# EAGLE design simple-loop-screwsfixed (EAGLE 6.6.0)

## Sheet 1 of 2
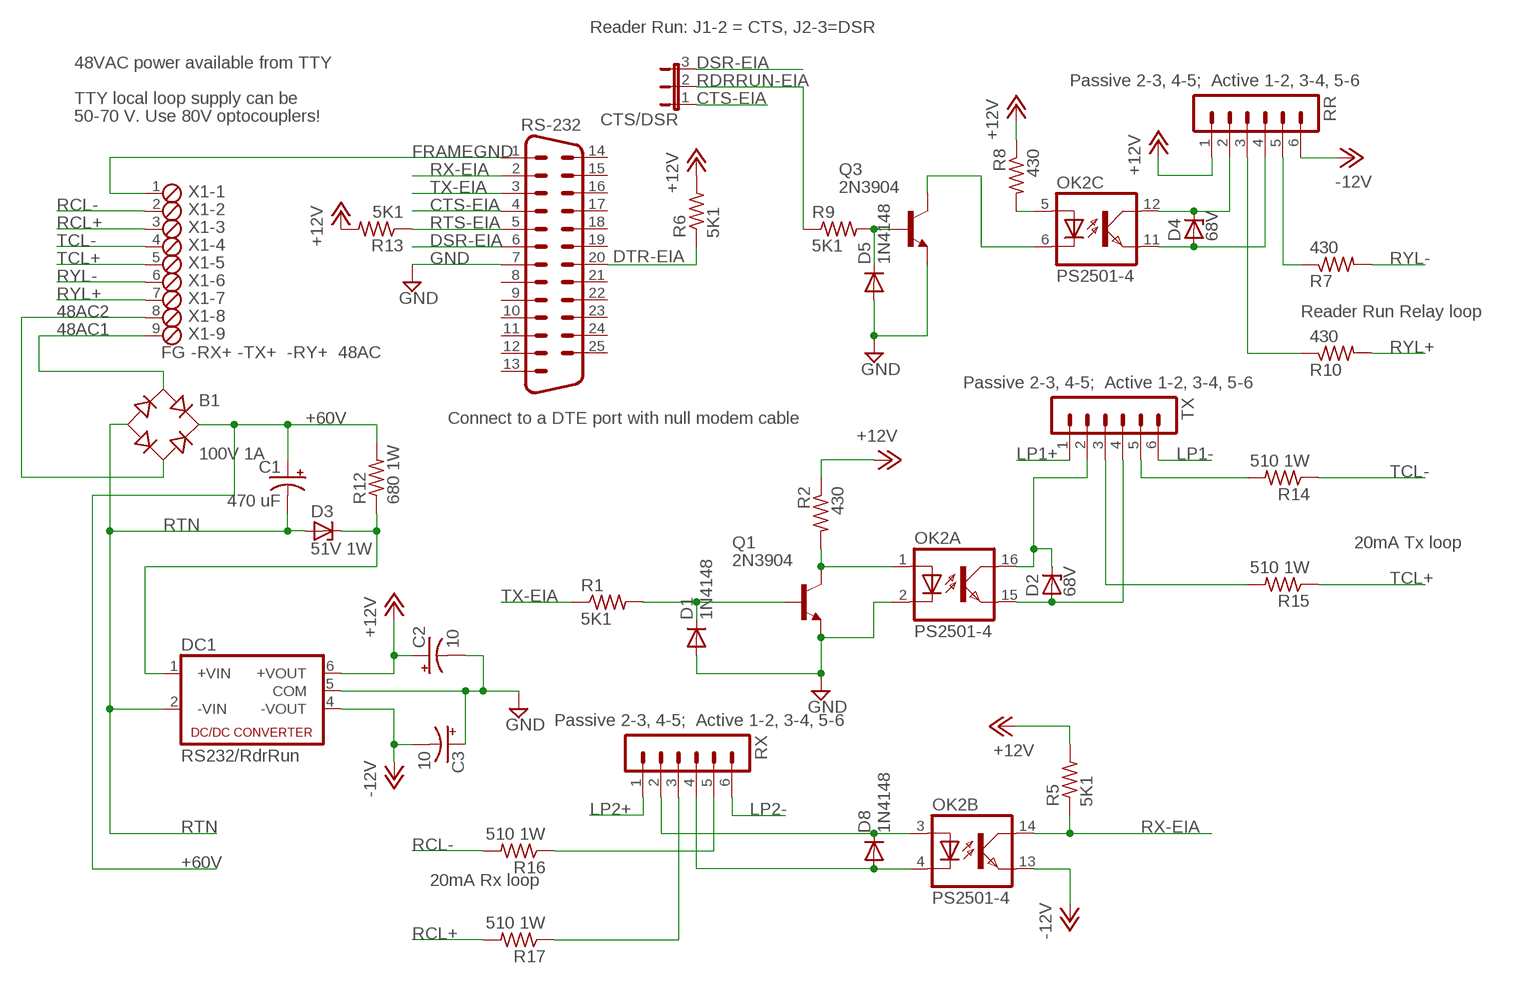
[diagram p0: schematic, sheet 1]

### Parts
B1  100V 1A  RB1A  [RB1A]
C1  470 uF  CPOL-USE7.5-18  [E7,5-18]
C2  10  CPOL-USB45181A  [B45181A]
C3  10  CPOL-USB45181A  [B45181A]
CTS/DSR  JP2E  [JP2]
D1  1N4148  1N4148DO35-10  [DO35-10]
D2  68V  ZENER-DIODEDO41Z10  [DO41Z10]
D3  51V 1W  ZENER-DIODEDO41Z10  [DO41Z10]
D4  68V  ZENER-DIODEDO41Z10  [DO41Z10]
D5  1N4148  1N4148DO35-10  [DO35-10]
D8  1N4148  1N4148DO35-10  [DO35-10]
DC1  RS232/RdrRun  NMA  [NMA]
OK2  PS2501-4  PC847  [DIL16]
Q1  2N3904  [TO92]
Q3  2N3904  [TO92]
R1  5K1  R-US_0207/10  [0207/10]
R2  430  R-US_0207/10  [0207/10]
R5  5K1  R-US_0207/10  [0207/10]
R6  5K1  R-US_0207/10  [0207/10]
R7  430  R-US_0207/10  [0207/10]
R8  430  R-US_0207/10  [0207/10]
R9  5K1  R-US_0207/10  [0207/10]
R10  430  R-US_0207/10  [0207/10]
R12  680 1W  R-US_0817/7V  [P0817V]
R13  5K1  R-US_0207/10  [0207/10]
R14  510 1W  R-US_0817/7V  [P0817V]
R15  510 1W  R-US_0817/7V  [P0817V]
R16  510 1W  R-US_0817/7V  [P0817V]
R17  510 1W  R-US_0817/7V  [P0817V]
RR  MA06-1  [MA06-1]
RS-232  M25H  [M25H]
RX  MA06-1  [MA06-1]
TX  MA06-1  [MA06-1]
X1  FG -RX+ -TX+ -RY+ 48AC  MPT9  [9POL254]

### Nets
48AC1: B1.AC1 X1.9
48AC2: B1.AC2 X1.8
+12V: C2.+ DC1.6(+VOUT) R2.1 R5.2 R6.2 R8.1 R13.2 RR.1
+48VDC: D3.C DC1.1(+VIN) R12.1
+60V: B1.+ C1.+ R12.2 ; also sheet 2
-12V: C3.- DC1.4(-VOUT) OK2.13(B:EMIT) RR.6
CTS-EIA: CTS/DSR.1 RS-232.4
DSR-EIA: CTS/DSR.3 RS-232.6
DTR-EIA: R6.1 RS-232.20
FRAMEGND: RS-232.1 X1.1
GND [GND]: C2.- C3.+ D1.A D5.A DC1.5(COM) OK2.2(A:C) Q1.3(E) Q3.3(E) RS-232.7
LP1+: TX.1 ; also sheet 2
LP1-: TX.6 ; also sheet 2
LP2+: RX.1 ; also sheet 2
LP2-: RX.6 ; also sheet 2
N$1: D8.C OK2.3(B:A) RX.2
N$2: R16.1 RX.5
N$3: D8.A OK2.4(B:C) RX.4
N$4: D2.A OK2.15(A:EMIT) TX.4
N$5: OK2.5(C:A) R8.2
N$6: D2.C OK2.16(A:COL) TX.2
N$7: D1.C Q1.2(B) R1.2
N$8: D4.C OK2.12(C:COL) RR.2
N$9: OK2.1(A:A) Q1.1(C) R2.2
N$10: R10.1 RR.3
N$11: R7.1 RR.5
N$15: OK2.6(C:C) Q3.1(C)
N$16: D5.C Q3.2(B) R9.2
N$19: R14.2 TX.5
N$20: R17.1 RX.3
N$21: R15.2 TX.3
N$22: D4.A OK2.11(C:EMIT) RR.4
RCL+: R17.2 X1.3
RCL-: R16.2 X1.2
RDRRUN-EIA: CTS/DSR.2 R9.1
RTN: B1.- C1.- D3.A DC1.2(-VIN) ; also sheet 2
RTS-EIA: R13.1 RS-232.5
RX-EIA: OK2.14(B:COL) R5.1 RS-232.2
RYL+: R10.2 X1.7
RYL-: R7.2 X1.6
TCL+: R15.1 X1.5
TCL-: R14.1 X1.4
TX-EIA: R1.1 RS-232.3
Unconnected: RS-232.8 RS-232.9 RS-232.10 RS-232.11 RS-232.12 RS-232.13 RS-232.14 RS-232.15 RS-232.16 RS-232.17 RS-232.18 RS-232.19 RS-232.21 RS-232.22 RS-232.23 RS-232.24 RS-232.25

### Notes on the sheet
- Reader Run: J1-2 = CTS, J2-3=DSR
- 48VAC power available from TTY
- Passive 2-3, 4-5;  Active 1-2, 3-4, 5-6
- TTY local loop supply can be
- 50-70 V. Use 80V optocouplers!
- Reader Run Relay loop
- Passive 2-3, 4-5;  Active 1-2, 3-4, 5-6
- Connect to a DTE port with null modem cable
- 20mA Tx loop
- Passive 2-3, 4-5;  Active 1-2, 3-4, 5-6
- 20mA Rx loop

## Sheet 2 of 2
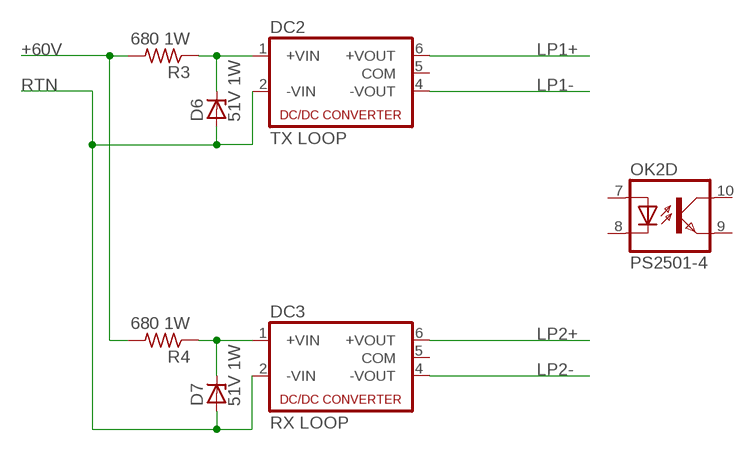
[diagram p1: schematic, sheet 2]

### Parts
D6  51V 1W  ZENER-DIODEDO41Z10  [DO41Z10]
D7  51V 1W  ZENER-DIODEDO41Z10  [DO41Z10]
DC2  TX LOOP  NMA  [NMA]
DC3  RX LOOP  NMA  [NMA]
R3  680 1W  R-US_0817/7V  [P0817V]
R4  680 1W  R-US_0817/7V  [P0817V]

### Nets
+48VDC1: D6.C DC2.1(+VIN) R3.1
+48VDC2: D7.C DC3.1(+VIN) R4.1
+60V: R3.2 R4.2 ; also sheet 1
LP1+: DC2.6(+VOUT) ; also sheet 1
LP1-: DC2.4(-VOUT) ; also sheet 1
LP2+: DC3.6(+VOUT) ; also sheet 1
LP2-: DC3.4(-VOUT) ; also sheet 1
RTN: D6.A D7.A DC2.2(-VIN) DC3.2(-VIN) ; also sheet 1
Unconnected: DC2.5(COM) DC3.5(COM) OK2.7(D:A) OK2.8(D:C) OK2.9(D:EMIT) OK2.10(D:COL)

## Library data of the parts
B1 = rectifier:RB1A: RECTIFIER 1 A
C1-C3 = rcl:CPOL-US: POLARIZED CAPACITOR, American symbol
CTS/DSR = jumper:JP2E: JUMPER
D1 D5 D8 = diode:1N4148: DIODE high speed (Philips)
D2-D4 D6 D7 = diode:ZENER-DIODE: Z-Diode
DC1-DC3 = dc-dc-converter:NMA: DC-DC CONVERTER; MF: C & D TECHNOLOGIES, INC; MPN: NMA0515SC; OC_FARNELL: 1021434; OC_NEWARK: 61K3064
OK2 = optocoupler:PC847: SHARP OPTO COUPLER; OC_FARNELL: 9707735; OC_NEWARK: unknown
Q1 Q3 = transistor-npn:2N3904: NPN Transistor
R1-R10 R12-R17 = rcl:R-US_: RESISTOR, American symbol
RR RX TX = con-lstb:MA06-1: PIN HEADER; OC_FARNELL: unknown; OC_NEWARK: unknown
RS-232 = con-subd:M25: SUB-D; OC_FARNELL: unknown; OC_NEWARK: unknown
X1 = con-phoenix-254:MPT9: PHOENIX CONNECTOR; OC_FARNELL: unknown; OC_NEWARK: unknown

## Net classes
1 GND: width 0.508 mm

## Board
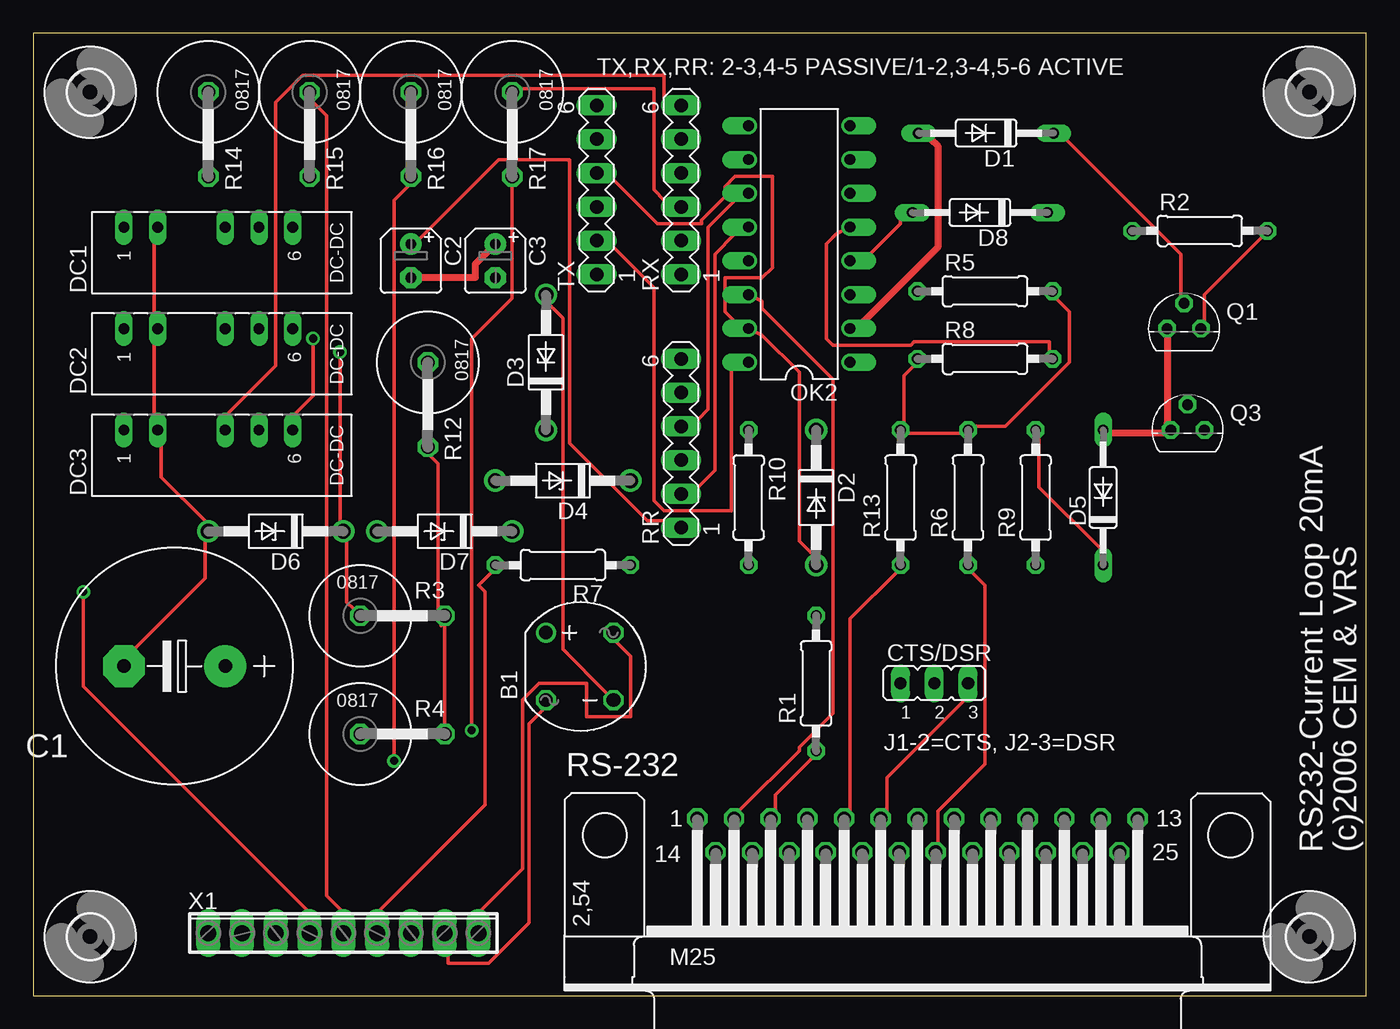
[diagram p2: board, top side]
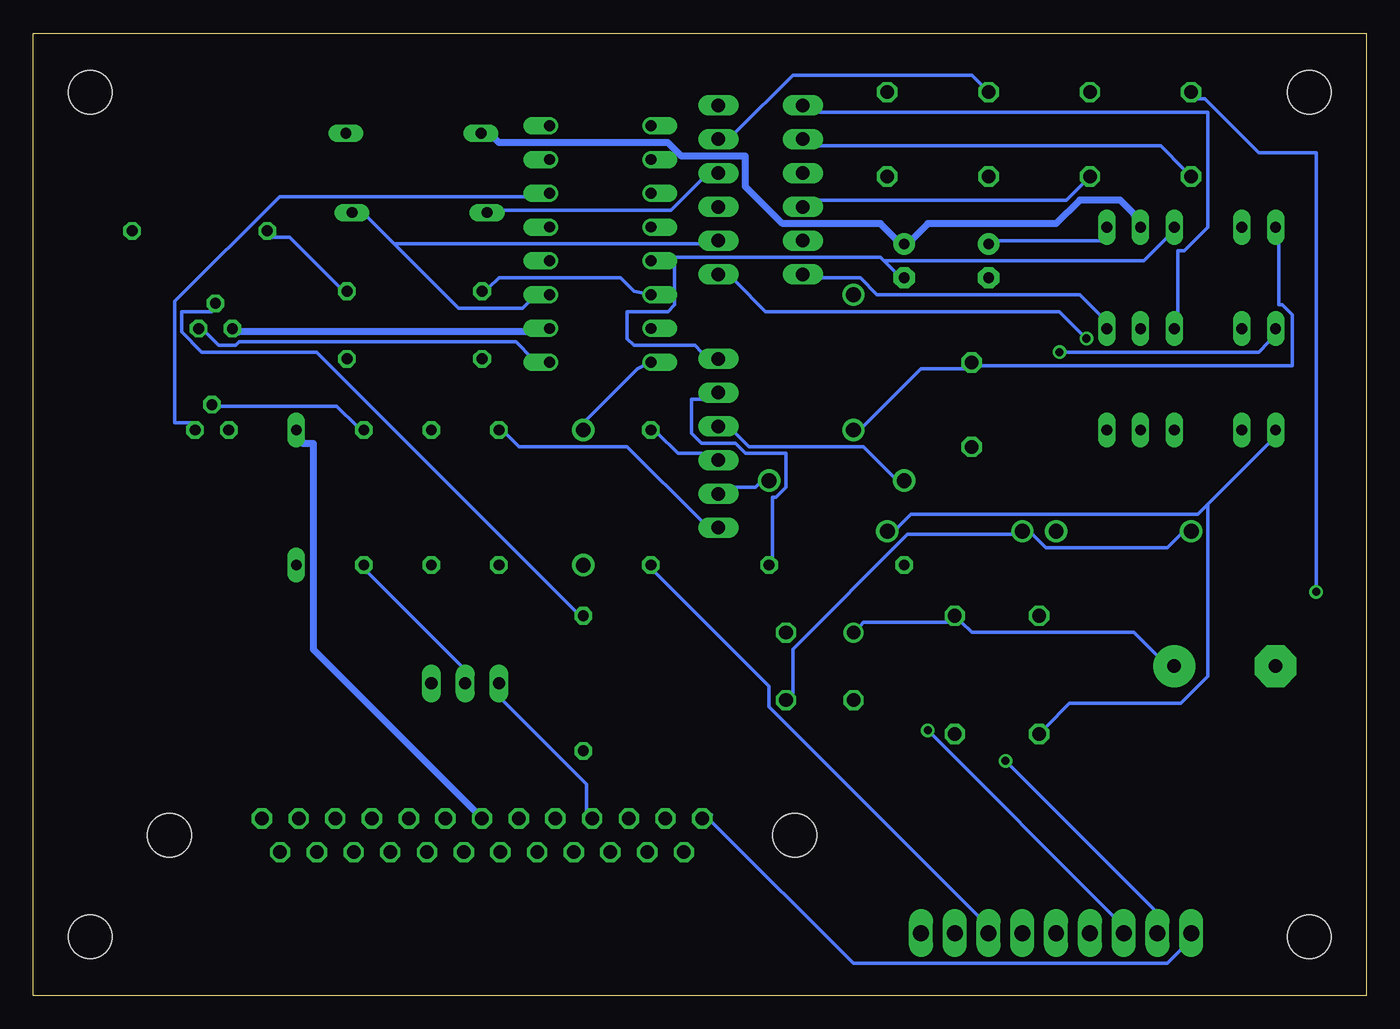
[diagram p3: board, bottom side, seen from below]

Size 100.27 x 72.37 mm. Coordinates in mm from the lower left corner, seen from the top.
Outline: 100.27,0 100.27,72.37 0,72.37 0,0 100.27,0
Copper layers (1*16): Top 0.035mm / dielectric 1.5mm / Bottom 0.035mm
Design rules "10mils *": minimum track width 10mil, minimum drill 24mil, track to track 10mil, track to pad 10mil, pad to pad 10mil, via to via 10mil, smd to smd 10mil, copper to edge 40mil, drill to drill 10mil, minimum pad ring 10mil, minimum via ring 8mil, stop-mask expansion 0mil, vias tented up to drill 0mil, thermal gap 10mil

### Footprints (pad centres in the part's own frame; a part is rotated, then mirrored left to right if it is on the bottom)
RB1A = drill 1.016: + -2.54,2.54 | drill 1.016 octagon: - 2.54,-2.54; AC1 2.54,2.54; AC2 -2.54,-2.54
E7,5-18 = drill 1.016 pad 3.15: + -3.81,0 | drill 1.016 pad 3.15 octagon: - 3.81,0
B45181A = drill 0.813 pad 1.6: + -1.27,0 | drill 0.813 pad 1.6 octagon: - 1.27,0
JP2 = drill 0.914 long: 1 -2.54,0; 2 0,0; 3 2.54,0
DO35-10 = drill 0.813 long: A 5.08,0; C -5.08,0
DO41Z10 = drill 1.118: A 5.08,0; C -5.08,0
NMA = drill 0.813 long: 1 0,6.35; 2 0,3.81; 4 0,-1.27; 5 0,-3.81; 6 0,-6.35
DIL16 = drill 0.813 offset: 1 -8.89,-3.81; 2 -6.35,-3.81; 3 -3.81,-3.81; 4 -1.27,-3.81; 5 1.27,-3.81; 6 3.81,-3.81; 7 6.35,-3.81; 8 8.89,-3.81; 9 8.89,3.81; 10 6.35,3.81; 11 3.81,3.81; 12 1.27,3.81; 13 -1.27,3.81; 14 -3.81,3.81; 15 -6.35,3.81; 16 -8.89,3.81
TO92 = drill 0.813 octagon: 1 1.27,0; 2 0,1.905; 3 -1.27,0
0207/10 = drill 0.813 octagon: 1 -5.08,0; 2 5.08,0
P0817V = drill 1.016 octagon: 1 -5.08,0; 2 1.27,0
MA06-1 = drill 1.016 long: 1 -6.35,0; 2 -3.81,0; 3 -1.27,0; 4 1.27,0; 5 3.81,0; 6 6.35,0
M25H = drill 1.016 octagon: 1 -16.561,1.27; 2 -13.792,1.27; 3 -11.049,1.27; 4 -8.28,1.27; 5 -5.512,1.27; 6 -2.769,1.27; 7 0,1.27; 8 2.769,1.27; 9 5.512,1.27; 10 8.28,1.27; 11 11.049,1.27; 12 13.792,1.27; 13 16.561,1.27; 14 -15.189,-1.27; 15 -12.421,-1.27; 16 -9.652,-1.27; 17 -6.909,-1.27; 18 -4.14,-1.27; 19 -1.372,-1.27; 20 1.372,-1.27; 21 4.14,-1.27; 22 6.909,-1.27; 23 9.652,-1.27; 24 12.421,-1.27; 25 15.189,-1.27 | hole 3.302: 23.52,0; -23.52,0
3,3 = hole 3.3: 0,0
9POL254 = drill 1.2 long: 1 -10.16,0; 2 -7.62,0; 3 -5.08,0; 4 -2.54,0; 5 0,0; 6 2.54,0; 7 5.08,0; 8 7.62,0; 9 10.16,0

### Placement (x,y rotation side)
B1  41.11,24.76 0 top
C1  10.63,24.78 180 top
C2  28.41,55.26 270 top
C3  34.76,55.26 270 top
CTS/DSR  67.78,23.49 0 top
D1  71.67,64.86 180 top
D2  58.89,37.46 270 top
D3  38.57,47.62 90 top
D4  39.84,38.73 180 top
D5  80.48,37.46 90 top
D6  18.25,34.92 180 top
D7  30.95,34.92 180 top
D8  71.21,58.89 180 top
DC1  13.17,57.78 90 top
DC2  13.17,50.16 90 top
DC3  13.17,42.54 90 top
OK2  57.62,56.53 90 top
Q1  86.56,50.16 0 top
Q3  86.83,42.54 0 top
R1  58.89,23.49 90 top
R2  87.75,57.51 0 top
R3  29.68,28.57 0 top
R4  29.68,19.68 0 top
R5  71.59,52.97 0 top
R6  70.32,37.46 90 top
R7  39.84,32.38 180 top
R8  71.59,47.89 0 top
R9  75.4,37.46 90 top
R10  53.81,37.46 270 top
R12  29.68,42.54 270 top
R13  65.24,37.46 90 top
R14  13.17,62.86 270 top
R15  20.79,62.86 270 top
R16  28.41,62.86 270 top
R17  36.03,62.86 270 top
RR  48.73,41.54 90 top
RS-232  66.51,12.06 0 top
RX  48.73,60.59 90 top
TX  42.38,60.59 90 top
U$1  [3,3]  4.28,67.94 0 top
U$2  [3,3]  4.28,4.44 0 top
U$3  [3,3]  95.99,67.94 0 top
U$4  [3,3]  95.99,4.44 0 top
X1  23.33,4.71 0 top

### Tracks (layer width: path | path; a pad name or v marks a point on that pad's centre or on a via)
48AC1
  Top 0.254: B1.AC1 43.9,26.55 44.92,25.54 44.92,20.97 41.62,20.97 41.62,23.51 38.06,23.51 36.79,22.24 36.79,9.54 33.74,6.49 X1.9
48AC2
  Top 0.254: B1.AC2 38.32,21.47 37.3,20.46 37.3,5.47 34.25,2.42 31.2,2.42 31.2,2.93 X1.8
+12V
  Top 0.254: R8.1 66.26,47.38 65.49,46.62 65.49,43.06 R13.2 65.75,42.3 69.81,42.3 R6.2 70.83,42.81 73.11,42.81 77.94,47.64 77.94,51.45 76.92,52.46 R5.2 | RR.1 47.46,35.7 46.19,35.7 40.35,41.54 40.35,62.88 35.01,62.88 28.92,56.78 28.92,56.53 C2.+
  Bottom 0.254: R5.2 77.18,53.22 80.99,57.03 82.26,57.03 R2.1 | DC1.6 20.03,56.78 28.16,56.78 C2.+ | RR.1 50,35.7 55.59,41.29 63.72,41.29 64.73,42.3 R13.2
+48VDC
  Bottom 0.254: DC1.1 6.57,56.53 6.57,51.95 6.31,51.95 5.55,51.19 5.55,47.38 29.17,47.38 R12.1 30.19,47.13 33.49,47.13 37.81,42.81 D3.C
+48VDC1  (via drill 0.61)
  Top 0.254: v23.08,48.4 23.08,35.7 D6.C 23.58,34.17 23.58,29.6 24.09,29.09 R3.1
  Bottom 0.254: v23.08,48.4 8.09,48.4 7.33,49.16 DC2.1
+48VDC2
  Bottom 0.254: 11.9,36.97 12.66,36.21 34.25,36.21 35.27,35.19 D7.C | 11.9,36.97 7.33,41.54 DC3.1 | 11.9,36.97 11.9,24.01 13.93,21.98 22.31,21.98 24.09,20.2 R4.1
+60V
  Top 0.254: R3.2 30.7,27.82 | R12.2 29.93,40.52 30.44,40.02 30.44,29.09 R3.2 | R3.2 R4.2
  Bottom 0.254: B1.+ 38.06,27.82 37.81,28.08 31.46,28.08 R3.2 30.44,28.08 29.68,27.32 17.49,27.32 15.2,25.03 14.69,25.03 C1.+
-12V
  Bottom 0.254: 36.28,55.26 36.54,55.51 52.03,55.51 | 36.28,55.26 35.27,54.24 35.01,54.24 C3.- | 52.03,55.51 52.54,55.51 OK2.13 | 52.03,55.51 52.03,51.95 52.54,51.45 55.59,51.45 55.59,49.41 55.08,48.91 50.51,48.91 50,48.4 RR.6 | 36.28,55.26 16.73,55.26 14.44,57.54 DC1.4
CTS-EIA
  Bottom 0.254: CTS/DSR.1 64.99,22.24 58.64,15.89 58.64,13.85 RS-232.4
DSR-EIA
  Top 0.254: CTS/DSR.3 70.07,22.24 64.22,16.39 64.22,13.85 RS-232.6
DTR-EIA
  Top 0.254: R6.1 70.57,31.89 71.59,30.87 71.59,17.41 68.03,13.85 68.03,11.31 RS-232.20
FRAMEGND
  Bottom 0.254: 49.24,13.6 RS-232.1 49.24,13.09 38.57,2.42 14.95,2.42 13.93,3.44 X1.1
GND
  Top 0.508: OK2.2 62.45,50.68 68.03,56.27 68.03,63.89 67.53,64.4 D1.A | D5.A 80.99,42.3 85.05,42.3 Q3.3 85.31,43.06 85.31,49.67 Q1.3 | C2.- 33.24,53.99 33.24,55 C3.+
  Bottom 0.508: DC1.5 17.49,58.81 18.5,59.83 21.55,59.83 23.33,58.05 32.98,58.05 34.25,56.78 34.51,56.78 C3.+ 34.76,56.78 35.27,56.78 36.54,58.05 43.9,58.05 46.7,60.84 46.7,63.13 51.52,63.13 52.54,64.15 65.24,64.15 65.49,64.4 D1.A | RS-232.7 67.02,13.85 79.21,26.05 79.21,41.54 79.97,41.54 D5.A | OK2.2 62.7,49.92 84.8,49.92 Q1.3
LP1+
  Bottom 0.254: DC2.6 20.03,51.19 21.55,52.72 36.79,52.72 38.06,53.99 41.11,53.99 TX.1
LP1-
  Bottom 0.254: DC2.4 14.19,51.45 14.19,56.02 13.68,56.02 11.9,57.8 11.9,66.43 41.11,66.43 TX.6
LP2+  (via drill 0.61)
  Top 0.254: v21.04,49.41 21.04,45.1 19.77,43.83 DC3.6
  Bottom 0.254: v21.04,49.41 23.08,51.45 45.17,51.45 47.46,53.73 RX.1
LP2-
  Top 0.254: DC3.4 14.69,43.83 18.25,47.38 18.25,67.19 20.28,69.23 47.46,69.23 47.46,67.45 RX.6
N$1
  Bottom 0.254: 73.11,56.53 75.15,58.56 D8.C | 73.11,56.53 68.29,51.7 63.46,51.7 62.7,52.46 OK2.3 | 73.11,56.53 50,56.53 RX.2
N$2
  Bottom 0.254: R16.1 28.92,68.46 29.68,69.23 43.14,69.23 47.46,64.91 RX.5
N$3
  Top 0.254: OK2.4 62.7,55.51 65.24,58.05 65.24,58.3 D8.A
  Bottom 0.254: RX.4 50,61.35 52.29,59.07 64.99,59.07 D8.A
N$4
  Top 0.254: D2.A 58.64,33.16 57.62,34.17 57.62,46.87 54.83,49.67 OK2.15 52.79,50.68 52.03,51.45 52.03,53.99 54.83,53.99 55.59,54.75 55.59,61.61 52.79,61.61 52.03,60.84 52.03,60.08 50.25,58.3 50.25,58.05 46.95,58.05 43.65,61.35 TX.4
N$5
  Top 0.254: OK2.5 60.41,57.29 59.65,56.53 59.65,49.41 60.16,48.91 66,48.91 66.26,49.16 76.42,49.16 76.42,48.4 R8.2
N$6
  Top 0.254: TX.2 43.65,56.27 46.7,53.22 46.7,37.22 47.46,36.46 52.54,36.46 52.54,47.38 OK2.16
  Bottom 0.254: OK2.16 54.83,47.13 58.64,43.32 D2.C
N$7
  Top 0.254: D1.C 77.69,64.4 86.32,55.76 86.32,52.72 Q1.2
  Bottom 0.254: R1.2 59.4,28.84 78.96,48.4 87.59,48.4 89.12,49.92 89.12,51.45 86.83,51.45 Q1.2
N$8
  Top 0.254: OK2.12 52.79,57.29 51.27,55.76 51.27,39.51 50,38.24 RR.2
  Bottom 0.254: D4.C 45.68,38.49 45.94,38.24 47.46,38.24 RR.2
N$9
  Top 0.254: R2.2 92.42,57.03 88.1,52.72 88.1,50.68 Q1.1
  Bottom 0.254: OK2.1 62.7,47.89 63.97,49.16 84.8,49.16 85.05,48.91 86.32,48.91 87.34,49.92 Q1.1
N$10
  Bottom 0.254: R10.1 53.3,42.3 51.78,40.78 50,40.78 RR.3
N$11
  Bottom 0.254: R7.1 44.67,32.9 44.67,37.48 44.41,37.48 43.65,38.24 43.65,40.78 46.7,40.78 47.46,41.54 50,41.54 50.76,42.3 50.76,44.84 50,44.84 RR.5
N$15
  Bottom 0.254: OK2.6 62.7,60.08 81.75,60.08 89.62,52.21 89.62,43.06 88.35,43.06 Q3.1
N$16
  Top 0.254: D5.C 80.23,33.67 75.65,38.24 75.65,42.05 R9.2
  Bottom 0.254: Q3.2 86.32,44.33 77.43,44.33 75.91,42.81 R9.2
N$19
  Bottom 0.254: R14.2 13.68,62.11 15.46,63.89 41.11,63.89 TX.5
N$20
  Top 0.254: R17.1 36.54,68.21 46.7,68.21 46.7,60.59 47.46,59.83 RX.3
N$21
  Bottom 0.254: R15.2 21.3,61.1 22.57,59.83 41.11,59.83 TX.3
N$22
  Top 0.254: OK2.11 52.79,59.83 50.76,57.8 50.76,44.08 50,43.32 RR.4
  Bottom 0.254: D4.A 35.52,39 37.81,41.29 46.44,41.29 47.46,42.3 RR.4
RCL+  (via drill 0.61)
  Top 0.254: R17.2 36.03,52.46 32.98,49.41 v32.98,19.95
  Bottom 0.254: v32.98,19.95 19.01,5.98 X1.3
RCL-  (via drill 0.61)
  Top 0.254: R16.2 28.16,60.84 27.14,59.83 v27.14,17.66
  Bottom 0.254: v27.14,17.66 15.96,6.49 X1.2
RDRRUN-EIA
  Bottom 0.254: R9.1 75.15,31.89 68.03,24.78 CTS/DSR.2
RTN
  Top 0.254: DC1.2 9.11,56.53 9.11,51.45 DC2.2 9.11,48.91 9.11,43.83 DC3.2 9.61,41.29 9.61,39 12.92,35.7 D6.A 12.92,34.17 12.92,31.38 7.07,25.54 7.07,25.03 C1.- | D3.A 38.82,51.95 39.84,50.94 39.84,26.05 43.14,22.74 B1.-
  Bottom 0.254: B1.- 43.14,22.74 43.14,26.05 34.51,34.68 26.63,34.68 D7.A 25.11,34.68 24.09,33.67 14.95,33.67 13.93,34.68 D6.A
RTS-EIA
  Top 0.254: R13.1 64.99,31.89 61.43,28.33 61.43,13.85 RS-232.5
RX-EIA
  Top 0.254: OK2.14 54.83,52.21 54.83,51.7 60.16,46.37 60.16,21.22 57.62,18.68 57.62,18.43 53.05,13.85 RS-232.2
  Bottom 0.254: OK2.14 55.08,52.97 56.1,53.99 65.24,53.99 66,53.22 R5.1
RYL+
  Bottom 0.254: R10.2 53.56,31.89 44.92,23.25 44.92,21.73 29.17,5.98 X1.7
RYL-
  Top 0.254: R7.2 34.51,31.89 33.49,30.87 34,30.36 34,14.36 26.12,6.49 X1.6
TCL+
  Top 0.254: R15.1 21.04,67.19 22.06,66.18 22.06,7.5 23.08,6.49 X1.5
TCL-  (via drill 0.61)
  Top 0.254: v3.77,30.36 3.77,23.25 20.54,6.49 X1.4
  Bottom 0.254: v3.77,30.36 3.77,63.38 8.09,63.38 12.15,67.45 12.66,67.45 R14.1
TX-EIA
  Top 0.254: R1.1 58.64,17.92 55.84,15.12 55.84,13.85 RS-232.3

### Text on the board
tNames: TX,RX,RR: 2-3,4-5 PASSIVE/1-2,3-4,5-6 ACTIVE | J1-2=CTS, J2-3=DSR | RS232-Current Loop 20mA | (c)2006 CEM & VRS